# EAGLE schematic PixelBar-w6Pixels (EAGLE 6.0)
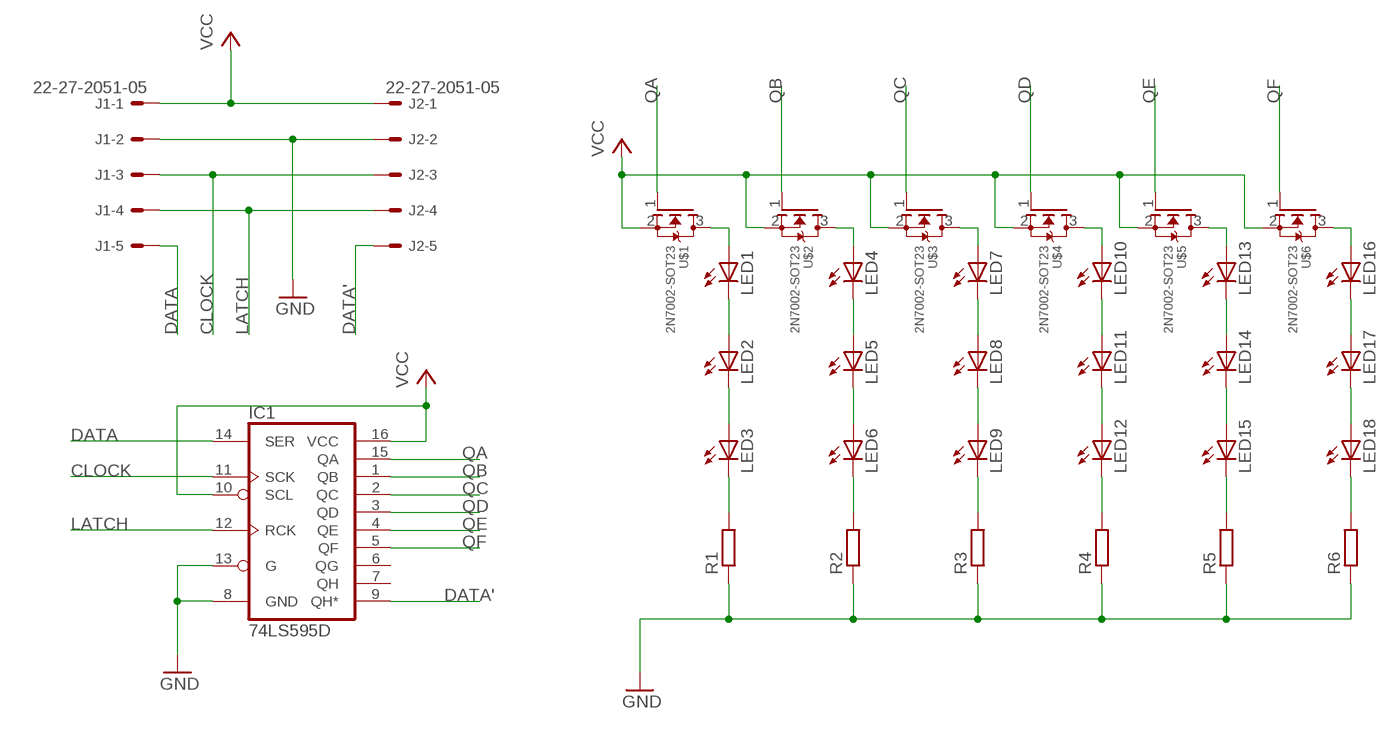
[diagram p0: schematic, sheet 1]

## Parts
IC1  74LS595D  [SO16]
J1  22-27-2051-05  [6410-05]
J2  22-27-2051-05  [6410-05]
LED1  LED5MM  [LED5MM]
LED2  LED5MM  [LED5MM]
LED3  LED5MM  [LED5MM]
LED4  LED5MM  [LED5MM]
LED5  LED5MM  [LED5MM]
LED6  LED5MM  [LED5MM]
LED7  LED5MM  [LED5MM]
LED8  LED5MM  [LED5MM]
LED9  LED5MM  [LED5MM]
LED10  LED5MM  [LED5MM]
LED11  LED5MM  [LED5MM]
LED12  LED5MM  [LED5MM]
LED13  LED5MM  [LED5MM]
LED14  LED5MM  [LED5MM]
LED15  LED5MM  [LED5MM]
LED16  LED5MM  [LED5MM]
LED17  LED5MM  [LED5MM]
LED18  LED5MM  [LED5MM]
R1  RESISTOR-1/4W-SMD-1206  [R1206]
R2  RESISTOR-1/4W-SMD-1206  [R1206]
R3  RESISTOR-1/4W-SMD-1206  [R1206]
R4  RESISTOR-1/4W-SMD-1206  [R1206]
R5  RESISTOR-1/4W-SMD-1206  [R1206]
R6  RESISTOR-1/4W-SMD-1206  [R1206]
U$1  2N7002-SOT23  [SOT23]
U$2  2N7002-SOT23  [SOT23]
U$3  2N7002-SOT23  [SOT23]
U$4  2N7002-SOT23  [SOT23]
U$5  2N7002-SOT23  [SOT23]
U$6  2N7002-SOT23  [SOT23]

## Nets
CLOCK: IC1.11(SCK) J1.3 J2.3
DATA: IC1.14(SER) J1.5
DATA': IC1.9(QH*) J2.5
GND: IC1.8(GND) IC1.13(G) J1.2 J2.2 R1.P$1 R2.P$1 R3.P$1 R4.P$1 R5.P$1 R6.P$1
LATCH: IC1.12(RCK) J1.4 J2.4
N$1: LED1.K(C) LED2.A
N$2: LED2.K(C) LED3.A
N$3: LED4.K(C) LED5.A
N$4: LED5.K(C) LED6.A
N$5: LED3.K(C) R1.P$2
N$6: LED6.K(C) R2.P$2
N$7: LED9.K(C) R3.P$2
N$8: LED12.K(C) R4.P$2
N$9: LED8.K(C) LED9.A
N$10: LED11.K(C) LED12.A
N$11: LED15.K(C) R5.P$2
N$12: LED18.K(C) R6.P$2
N$13: LED14.K(C) LED15.A
N$14: LED17.K(C) LED18.A
N$15: LED16.K(C) LED17.A
N$16: LED13.K(C) LED14.A
N$17: LED10.K(C) LED11.A
N$18: LED7.K(C) LED8.A
N$19: LED1.A U$1.3(D)
N$20: LED4.A U$2.3(D)
N$21: LED7.A U$3.3(D)
N$22: LED10.A U$4.3(D)
N$23: LED13.A U$5.3(D)
N$24: LED16.A U$6.3(D)
QA: IC1.15(QA) U$1.1(G)
QB: IC1.1(QB) U$2.1(G)
QC: IC1.2(QC) U$3.1(G)
QD: IC1.3(QD) U$4.1(G)
QE: IC1.4(QE) U$5.1(G)
QF: IC1.5(QF) U$6.1(G)
VCC: IC1.10(SCL) IC1.16(VCC) J1.1 J2.1 U$1.2(S) U$2.2(S) U$3.2(S) U$4.2(S) U$5.2(S) U$6.2(S)
Unconnected: IC1.6(QG) IC1.7(QH)

## Library data of the parts
IC1 = SparkFun:74*595: 8-bit SHIFT REGISTER, output latch
J1 J2 = con-molex:22-?-05: CONNECTOR wire to board 2.54 mm (.1 inch) pitch header; OC_FARNELL: unknown; OC_NEWARK: unknown
LED1-LED18 = led:LED: LED OSRAM: - CHIPLED LG R971, LG N971, LY N971, LG Q971, LY Q971, LO R971, LY R971 LH N974, LH R974 LS Q976, LO Q976, LY Q976 LO Q996 - Hyper CHIPLED LW Q18S LB Q993, LB Q99A, LB R99A - SideLED LS A670, LO A670, LY A670, LG A670, LP A670 LB A673, LV A673, LT A673, LW A673 LH A674 LY A675 LS A676, LA A676, LO A676, LY A676, LW A676 LS A679, LY A679, LG A679 - Hyper Micro SIDELED® LS Y876, LA Y876, LO Y876, LY Y876 LT Y87S - SmartLED LW L88C, LW L88S LB L89C, LB L89S, LG L890 LS L89K, LO L89K, LY L89K LS L896, LA L896, LO L896, LY L896 - TOPLED LS T670, LO T670, LY T670, LG T670, LP T670 LSG T670, LSP T670, LSY T670, LOP T670, LYG T670 LG T671, LOG T671, LSG T671 LB T673, LV T673, LT T673, LW T673 LH T674 LS T676, LA T676, LO T676, LY T676, LB T676, LH T676, LSB T676, LW T676 LB T67C, LV T67C, LT T67C, LS T67K, LO T67K, LY T67K, LW E67C LS E67B, LA E67B, LO E67B, LY E67B, LB E67C, LV E67C, LT E67C LW T67C LS T679, LY T679, LG T679 LS T770, LO T770, LY T770, LG T770, LP T770 LB T773, LV T773, LT T773, LW T773 LH T774 LS E675, LA E675, LY E675, LS T675 LS T776, LA T776, LO T776, LY T776, LB T776 LHGB T686 LT T68C, LB T68C - Hyper Mini TOPLED® LB M676 - Mini TOPLED Santana® LG M470 LS M47K, LO M47K, LY M47K Source: http://www.osram.convergy.de LUXEON: - LUMILED® LXK2-PW12-R00, LXK2-PW12-S00, LXK2-PW14-U00, LXK2-PW14-V00 LXK2-PM12-R00, LXK2-PM12-S00, LXK2-PM14-U00 LXK2-PE12-Q00, LXK2-PE12-R00, LXK2-PE12-S00, LXK2-PE14-T00, LXK2-PE14-U00 LXK2-PB12-K00, LXK2-PB12-L00, LXK2-PB12-M00, LXK2-PB14-N00, LXK2-PB14-P00, LXK2-PB14-Q00 LXK2-PR12-L00, LXK2-PR12-M00, LXK2-PR14-Q00, LXK2-PR14-R00 LXK2-PD12-Q00, LXK2-PD12-R00, LXK2-PD12-S00 LXK2-PH12-R00, LXK2-PH12-S00 LXK2-PL12-P00, LXK2-PL12-Q00, LXK2-PL12-R00 Source: www.luxeon.com KINGBRIGHT: KA-3528ASYC Source: www.kingbright.com
R1-R6 = icmi-custom-parts:RESISTOR-1/4W
U$1-U$6 = icmi-custom-parts:2N7002: N-Channel 60-V (D-S) MOSFET